# Altium project OpticalProbeTest.PrjPcb
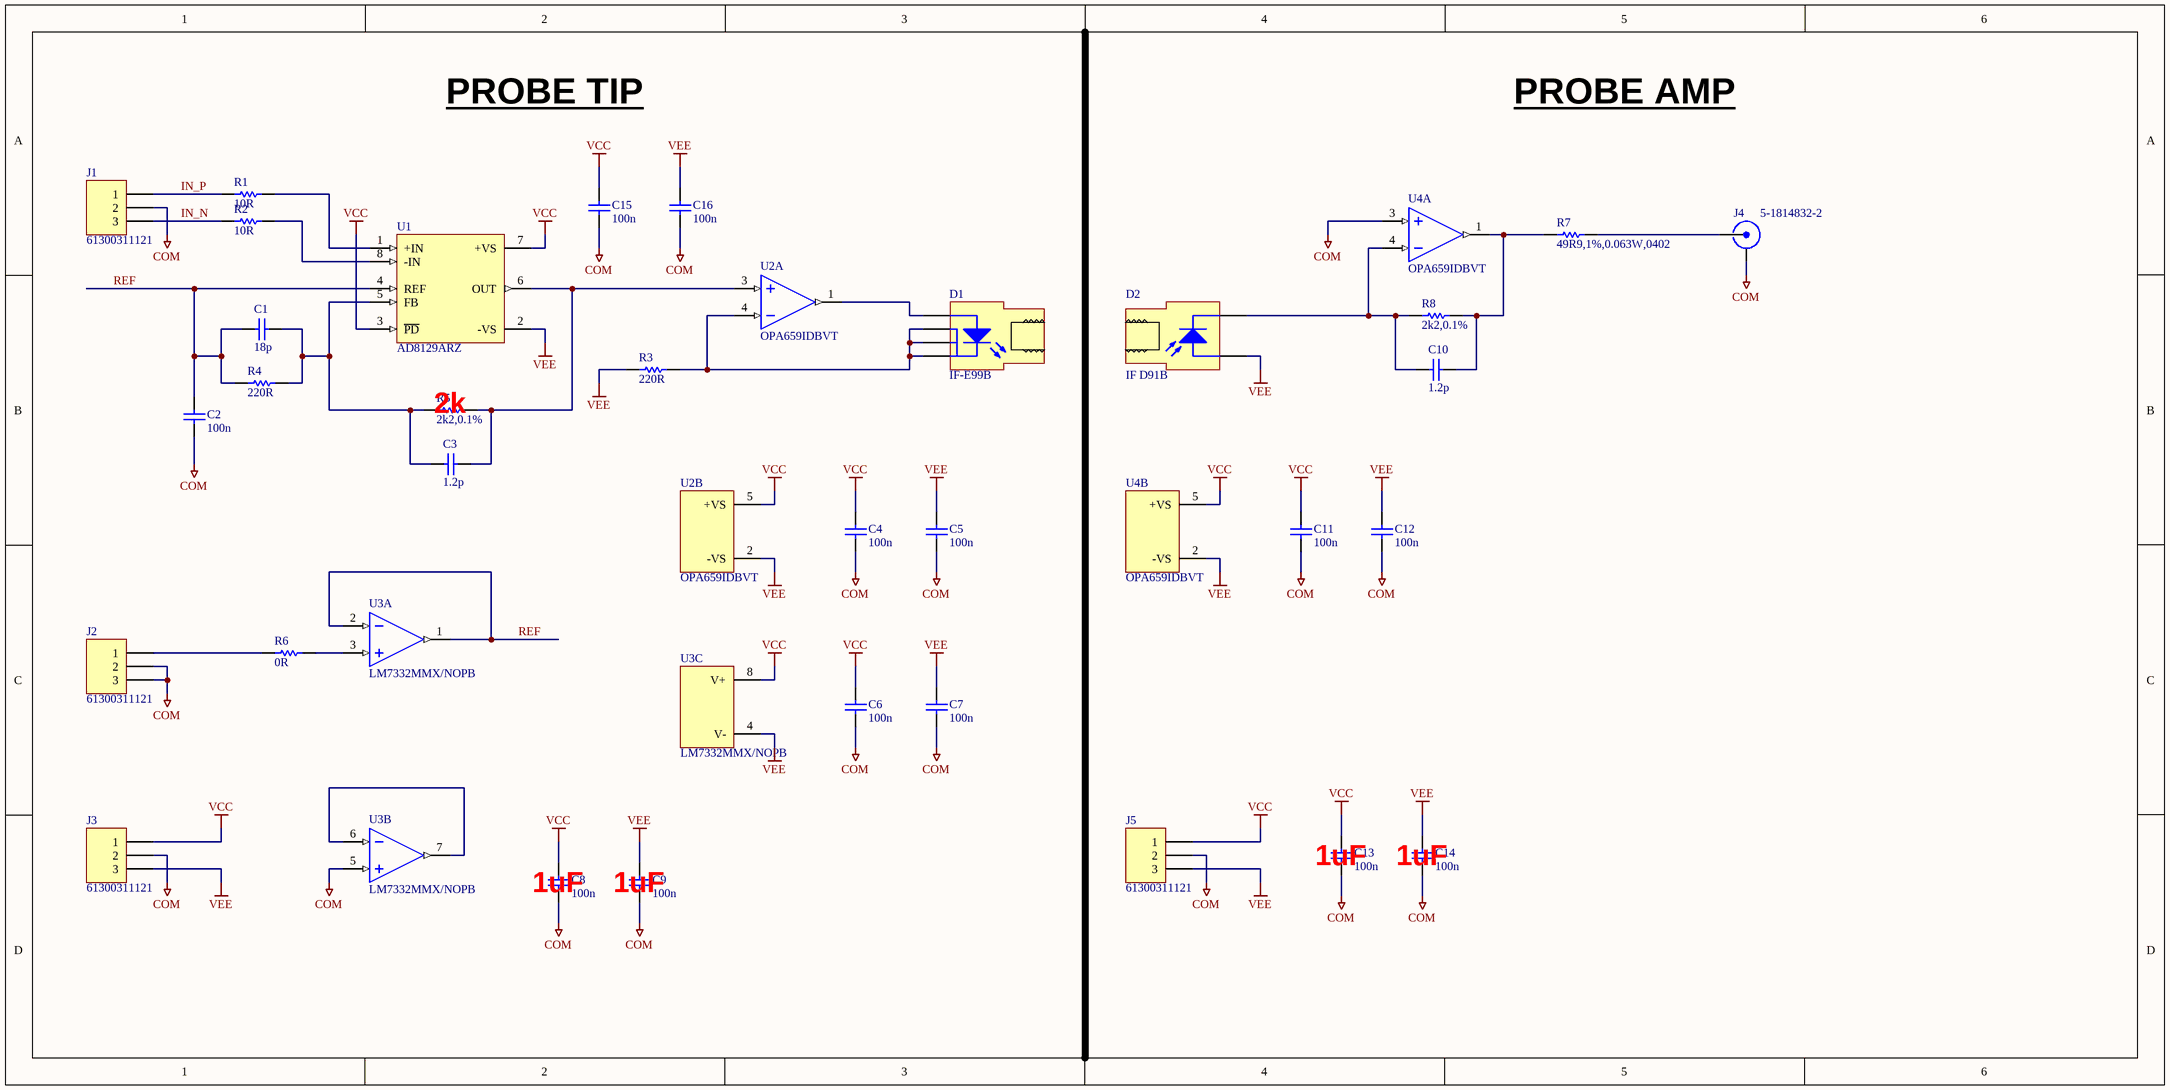
[diagram p0: OpticalProbeTest.SchDoc]
1 sheet, 35 parts. Net scope: global (net labels, ports and power ports of the same name join across sheets).
Board file: OpticalProbeTest.PcbDoc

## Sheet OpticalProbeTest.SchDoc
size 406 x 203 mm; SheetNumber: 1; SheetTotal: 1

### Parts
C1  18p  [CAPC1005X06N]
C2  100n  [CAPC1005X06N]
C3  1.2p  [CAPC1005X06N]
C4  100n  [CAPC1005X06N]
C5  100n  [CAPC1005X06N]
C6  100n  [CAPC1005X06N]
C7  100n  [CAPC1005X06N]
C8  100n  [CAPC_0805]
C9  100n  [CAPC_0805]
C10  1.2p  [CAPC1005X06N]
C11  100n  [CAPC1005X06N]
C12  100n  [CAPC1005X06N]
C13  100n  [CAPC_0805]
C14  100n  [CAPC_0805]
C15  100n  [CAPC1005X06N]
C16  100n  [CAPC1005X06N]
D1  IF-E99B  [INDUSTRIALFIBEROPTICS_IF-E99B]
D2  IF D91B  [INDUSTRIALFIBEROPTICS_IF-D91B]
J1  61300311121  [WURTH_61300311121]
J2  61300311121  [WURTH_61300311121]
J3  61300311121  [WURTH_61300311121]
J4  5-1814832-2  [TE_5-1814832-2]
J5  61300311121  [WURTH_61300311121]
R1  10R  [RESC1005X04N]
R2  10R  [RESC1005X04N]
R3  220R  [RESC1005X04N]
R4  220R  [RESC1005X04N]
R5  2k2,0.1%  [RESC1005X04N]
R6  0R  [RESC1005X04N]
R7  49R9,1%,0.063W,0402  [RESC1005X04N]
R8  2k2,0.1%  [RESC1005X04N]
U1  AD8129ARZ  [ANALOGDEVICES_PKG_R-8]
U2  OPA659IDBVT  [TEXASINSTRUMENTS_PKG_DBV0005A]  (parts A,B of 2)
U3  LM7332MMX/NOPB  [TEXASINSTRUMENTS_PKG_DGK0008A]  (parts A,B,C of 3)
U4  OPA659IDBVT  [TEXASINSTRUMENTS_PKG_DBV0005A]  (parts A,B of 2)

### Nets
COM: C2.1 C4.1 C5.1 C6.1 C7.1 C8.1 C9.1 C11.1 C12.1 C13.1 C14.1 C15.1 C16.1 J1.2 J2.2 J2.3 J3.2 J4.2(GND) J5.2 U3.5(INB+) U4.3(IN+)
VCC: C4.2 C6.2 C8.2 C11.2 C13.2 C15.2 J3.1 J5.1 U1.3(~{PD}) U1.7(+VS) U2.5(+VS) U3.8(V+) U4.5(+VS)
VEE: C5.2 C7.2 C9.2 C12.2 C14.2 C16.2 D2.1(A) J3.3 J5.3 R3.1 U1.2(-VS) U2.2(-VS) U3.4(V-) U4.2(-VS)
IN_N: J1.3 R2.1
IN_P: J1.1 R1.1
REF: C1.1 C2.2 R4.1 U1.4(REF) U3.1(OUTA) U3.2(INA-)
NetC1_2: C1.2 C3.2 R4.2 R5.1 U1.5(FB)
NetC3_1: C3.1 R5.2 U1.6(OUT) U2.3(IN+)
NetC10_1: C10.1 R7.1 R8.2 U4.1(OUT1)
NetC10_2: C10.2 D2.2(K) R8.1 U4.4(IN-)
NetD1_1: D1.1(K) D1.2(K) D1.4(K) R3.2 U2.4(IN-)
NetD1_3: D1.3(A) U2.1(OUT1)
NetJ2_1: J2.1 R6.1
NetJ4_1: J4.1(RF) R7.2
NetR1_2: R1.2 U1.1(+IN)
NetR2_2: R2.2 U1.8(-IN)
NetR6_2: R6.2 U3.3(INA+)
NetU3_6: U3.6(INB-) U3.7(OUTB)

### Notes on the sheet
- PROBE TIP
- PROBE AMP
- (near R5) 2k
- (near C8) 1uF
- (near C9) 1uF
- (near C13) 1uF
- (near C14) 1uF

### Library data of the parts
C1 = CAP,Cer,18pF,25VDC,C0G,0402: 18 pF ï¿½5% 25V Ceramic Capacitor C0G, NP0 0402 (1005 Metric); Manufacturer 1: Walsin Technology Corporation; Manufacturer 1 Part Number: 0402N180J250CT; Vendor 1 Part Number: 1292-1265-1-ND; Vendor 1: Digikey; Part Name: CAP,Cer,18pF,25VDC,C0G,0402; CreatedBy: Judd Foster; HelpURL: http://www.passivecomponent.com/wp-content/uploads/2018/10/MLCC.pdf; Value: 18p
C2 C4-C7 C11 C12 C15 C16 = CAP,Cer,100nF,25VDC,X7R,0402: 0.1ï¿½F ï¿½10% 25V Ceramic Capacitor X7R 0402 (1005 Metric); Manufacturer 1: Murata Electronics; Manufacturer 1 Part Number: GRM155R71E104KE14J; Vendor 1 Part Number: 490-14603-1-ND; Vendor 1: Digikey; Part Name: CAP,Cer,100nF,25VDC,X7R,0402; CreatedBy: Judd Foster; HelpURL: https://search.murata.co.jp/Ceramy/image/img/A01X/G101/ENG/GRM155R71E104KE14-01.pdf; Value: 100n
C3 C10 = CAP,Cer,1.2pF,50V,C0G,0402: 1.2 pF ï¿½0.1pF 50V Ceramic Capacitor C0G, NP0 0402 (1005 Metric); Manufacturer 1: Murata Electronics; Manufacturer 1 Part Number: GRM1555C1H1R2BA01D; Vendor 1 Part Number: 490-6209-1-ND; Vendor 1: Digikey; Part Name: CAP,Cer,1.2pF,50V,C0G,0402; CreatedBy: Judd Foster; HelpURL: https://search.murata.co.jp/Ceramy/image/img/A01X/G101/ENG/GRM1555C1H1R2BA01-01.pdf; Value: 1.2p
C8 C9 C13 C14 = CAP,Cer,100nF,50VDC,X7R,0805: CAP CER 0.1UF 50V X7R 0805; Manufacturer 1: KEMET; Manufacturer 1 Part Number: C0805C104M5RACTU; Vendor 1 Part Number: 399-1169-1-ND; Vendor 1: Digikey; Part Name: CAP,Cer,100nF,50VDC,X7R,0805; CreatedBy: Judd Foster; HelpURL: https://content.kemet.com/datasheets/KEM_C1002_X7R_SMD.pdf; Value: 100n
D1 = XMITTER,FIBER OPTIC,650NM,1.9V,IF-E99B: Fiber Optic Transmitter 650nm 1.9V 50 mA Connector-less; Manufacturer 1: Industrial Fiber Optics; Vendor 1 Part Number: FB161-ND; Vendor 1: DigiKey; Part Name: XMITTER,FIBER OPTIC,650NM,1.9V,IF-E99B; CreatedBy: Judd Foster; HelpURL: https://i-fiberoptics.com/pdf/if-e99bdatasheet.pdf; Manufacturer 1 Part Number: IF-E99B
D2 = RECEIVER,FIBER OPTIC,450-1050NM,IF-D91B: Fiber Optic Receiver General Purpose 100Mbps; Manufacturer 1: Industrial Fiber Optics; Vendor 1 Part Number: FB200-ND; Vendor 1: DigiKey; Part Name: RECEIVER,FIBER OPTIC,450-1050NM,IF-D91B; CreatedBy: Judd Foster; HelpURL: https://i-fiberoptics.com/pdf/ifd91b-1809.pdf; Manufacturer 1 Part Number: IF D91B
J1-J3 J5 = Term,Header,3 Pin,Top,2.54mm: CONN HEADER VERT 3POS 2.54MM; Manufacturer 1: Wï¿½rth Elektronik; Vendor 1 Part Number: 732-5316-ND; Vendor 1: Digikey; Part Name: Term,Header,3 Pin,Top,2.54mm; CreatedBy: Judd Foster; HelpURL: https://katalog.we-online.de/em/datasheet/6130xx11121.pdf; Manufacturer 1 Part Number: 61300311121
J4 = Conn,RF,SMA,Fem,50R,Thru: SMA Connector Jack, Female Socket 50Ohm Through Hole Solder; Manufacturer 1: TE Connectivity; Vendor 1 Part Number: C482015; Vendor 1: LCSC; Part Name: Conn,RF,SMA,Fem,50R,Thru; CreatedBy: Judd Foster; HelpURL: https://datasheet.lcsc.com/lcsc/2003251910_TE-Connectivity-5-1814832-2_C482015.pdf; Manufacturer 1 Part Number: 5-1814832-2
R1 R2 = RES,10R,1%,0.063W,0402: 10 Ohms ï¿½1% 0.063W, 1/16W Chip Resistor 0402 (1005 Metric) Automotive AEC-Q200 Thick Film; Manufacturer 1: Panasonic Electronic Components; Manufacturer 1 Part Number: ERJ-2RKF10R0X; Vendor 1 Part Number: P10.0LCT-ND; Vendor 1: Digikey; Part Name: RES,10R,1%,0.063W,0402; CreatedBy: Judd Foster; HelpURL: https://industrial.panasonic.com/cdbs/www-data/pdf/RDA0000/AOA0000C304.pdf; Value: 10R
R3 R4 = RES,220R,1%,0.063W,0402: 220 Ohms ï¿½1% 0.063W, 1/16W Chip Resistor 0402 (1005 Metric) Moisture Resistant Thick Film; Manufacturer 1: Yageo; Manufacturer 1 Part Number: RC0402FR-07220RL; Vendor 1 Part Number: 311-220LRCT-ND; Vendor 1: Digikey; Part Name: RES,220R,1%,0.063W,0402; CreatedBy: Judd Foster; HelpURL: https://www.yageo.com/upload/media/product/productsearch/datasheet/rchip/PYu-RC_Group_51_RoHS_L_12.pdf; Value: 220R
R5 R8 = RES,2k2,0.1%,0.063W,0402: 2.2 kOhms ï¿½0.1% 0.063W, 1/16W Chip Resistor 0402 (1005 Metric) Anti-Sulfur, Automotive AEC-Q200 Thin Film; Manufacturer 1: Susumu; Manufacturer 1 Part Number: RG1005P-222-B-T5; Vendor 1 Part Number: RG10P2.2KBCT-ND; Vendor 1: Digikey; Part Name: RES,2k2,0.1%,0.063W,0402; CreatedBy: Judd Foster; HelpURL: https://www.susumu.co.jp/common/pdf/n_catalog_partition01_en.pdf; Value: 2k2,0.1%
R6 = RES,0R0,0.1W,0402: 0 Ohms Jumper 0.1W, 1/10W Chip Resistor 0402 (1005 Metric) Automotive AEC-Q200 Thick Film; Manufacturer 1: Panasonic Electronic Components; Manufacturer 1 Part Number: ERJ-2GE0R00X; Vendor 1 Part Number: P0.0JCT-ND; Vendor 1: Digikey; Part Name: RES,0R0,0.1W,0402; CreatedBy: Judd Foster; HelpURL: https://industrial.panasonic.com/cdbs/www-data/pdf/RDA0000/AOA0000C301.pdf; Value: 0R
R7 = RES,49R9,1%,0.063W,0402: 49.9 Ohms Â±1% 0.063W, 1/16W Chip Resistor 0402 (1005 Metric) Moisture Resistant Thick Film; Manufacturer 1: YAGEO; Manufacturer 1 Part Number: RC0402FR-0749R9L; Vendor 1 Part Number: 311-49.9LRCT-ND; Vendor 1: DigiKey; Part Name: RES,49R9,1%,0.063W,0402; CreatedBy: Judd Foster; HelpURL: https://www.yageo.com/upload/media/product/products/datasheet/rchip/PYu-RC_Group_51_RoHS_L_12.pdf; Value: 49R9
U1 = AD8129ARZ: Differential Amplifier 1 Circuit 8-SOIC; Manufacturer 1: Analog Devices Inc.; Vendor 1 Part Number: 505-AD8129ARZ-ND; Vendor 1: DigiKey; Part Name: AD8129ARZ; CreatedBy: Judd Foster; HelpURL: https://www.analog.com/media/en/technical-documentation/data-sheets/AD8129_8130.pdf; Manufacturer 1 Part Number: AD8129ARZ
U2 U4 = OPA659IDBVT: J-FET Amplifier 1 Circuit SOT-23-5; Manufacturer 1: Texas Instruments; Vendor 1 Part Number: 296-24971-1-ND; Vendor 1: DigiKey; Part Name: OPA659IDBVT; CreatedBy: Judd Foster; HelpURL: https://www.ti.com/lit/ds/symlink/opa659.pdf?HQS=dis-dk-null-digikeymode-dsf-pf-null-wwe&ts=1730770701398&ref_url=https%253A%252F%252Fwww.ti.com%252Fgeneral%252Fdocs%252Fsuppproductinfo.tsp%253FdistId%253D10%2526gotoUrl%253Dhttps%253A%252F%252Fwww.ti.com%; Manufacturer 1 Part Number: OPA659IDBVT
U3 = LM7332MMX_NOPB: General Purpose Amplifier 2 Circuit Rail-to-Rail 8-VSSOP; Manufacturer 1: Texas Instruments; Vendor 1 Part Number: 296-LM7332MMX/NOPBCT-ND; Vendor 1: DigiKey; Part Name: LM7332MMX_NOPB; CreatedBy: Judd Foster; HelpURL: https://www.ti.com/lit/ds/symlink/lm7332.pdf?HQS=dis-dk-null-digikeymode-dsf-pf-null-wwe&ts=1730932081789&ref_url=https%253A%252F%252Fwww.ti.com%252Fgeneral%252Fdocs%252Fsuppproductinfo.tsp%253FdistId%253D10%2526gotoUrl%253Dhttps%253A%252F%252Fwww.ti.com%; Manufacturer 1 Part Number: LM7332MMX/NOPB